# EAGLE design SuperPET OS9 MMU 3.0 (EAGLE 7.7.0)
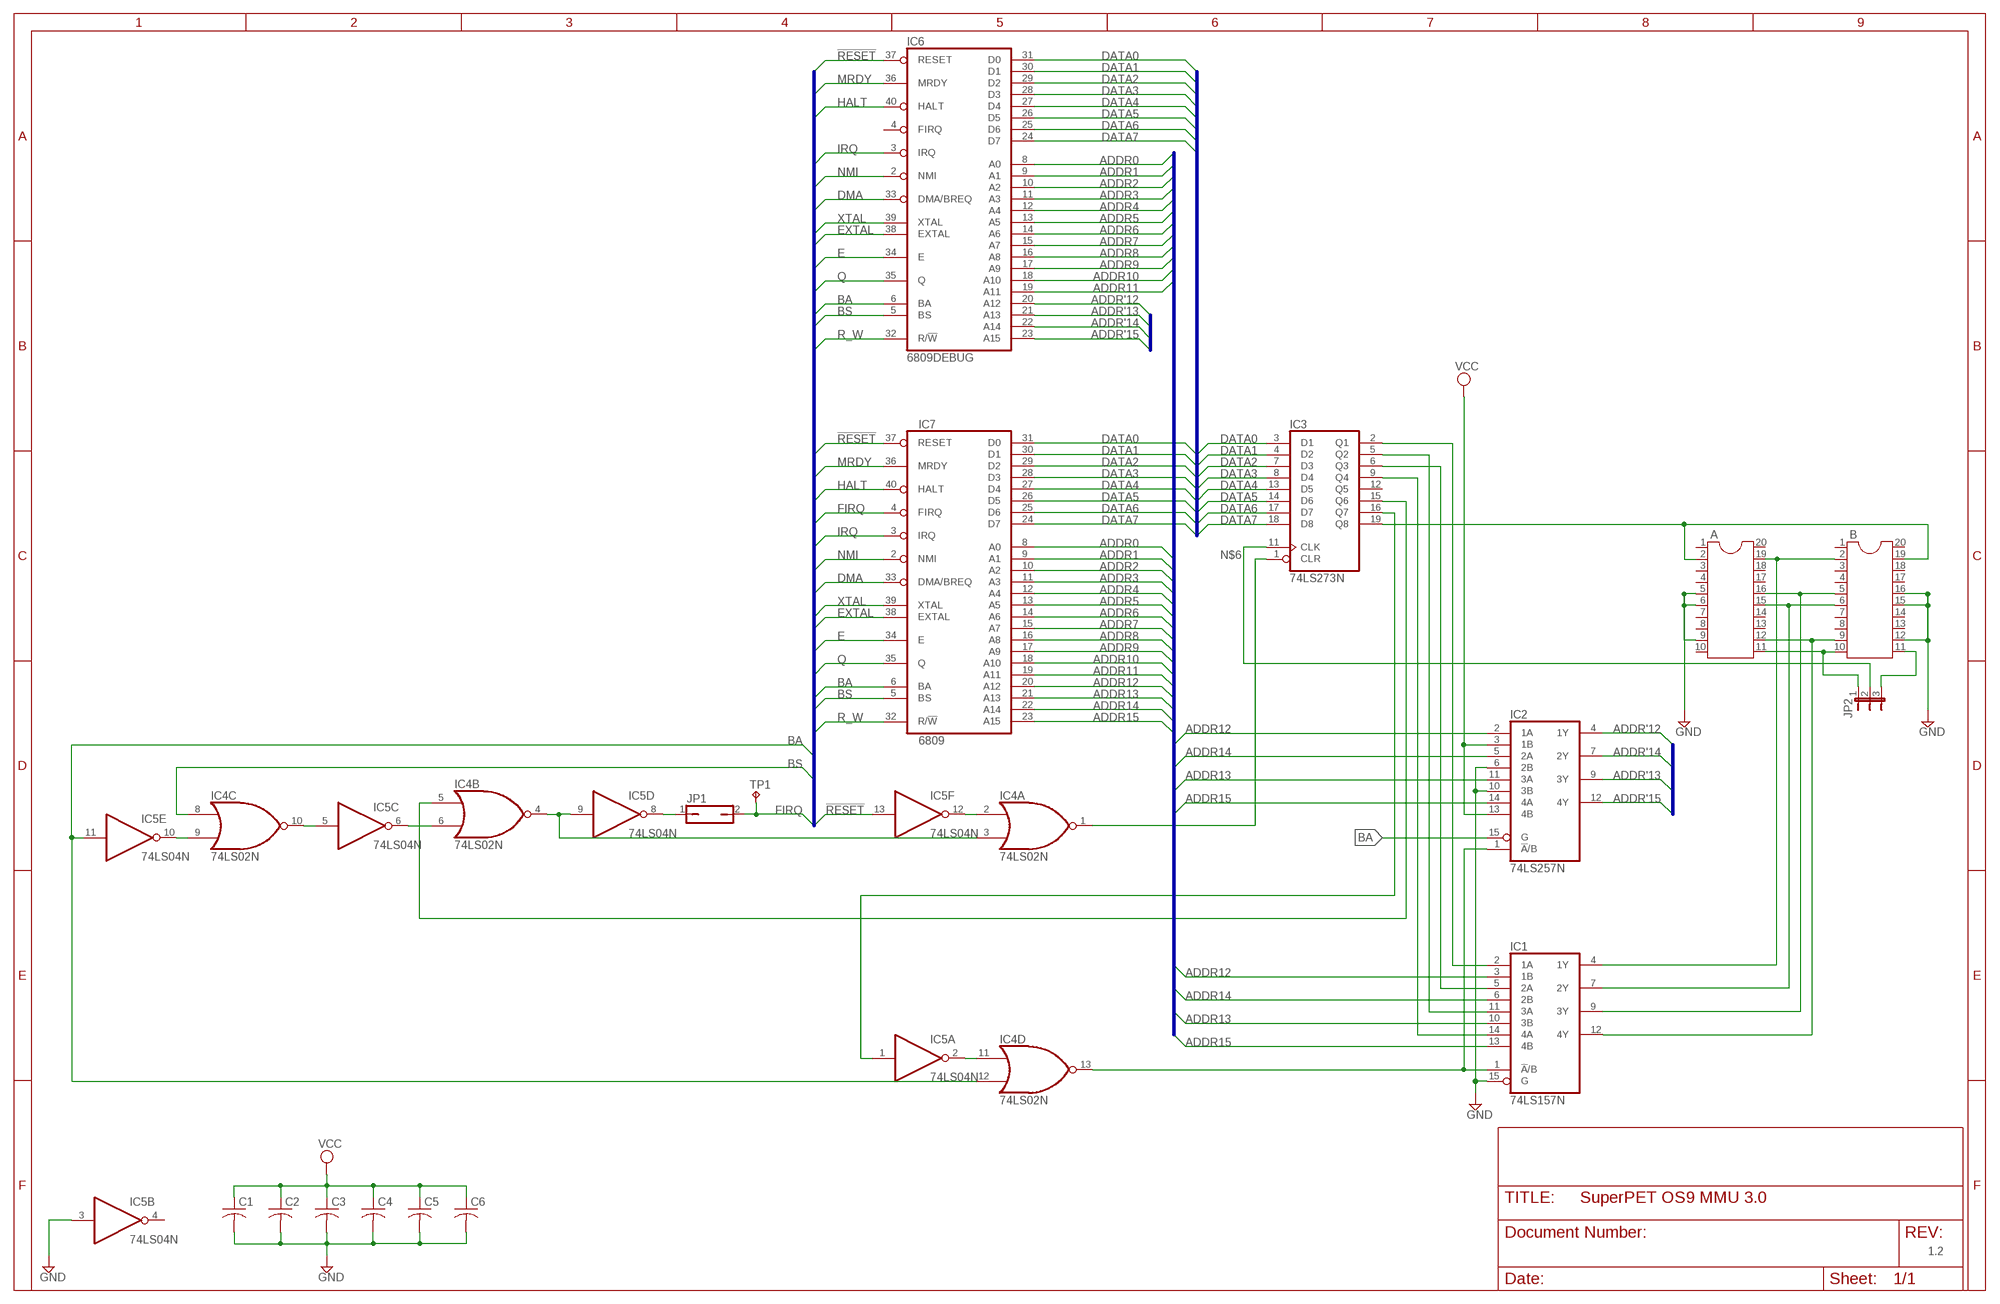
[diagram p0: schematic, sheet 1]

## Parts
A  DIL20S  [SOCKET-20]
B  DIL20S  [SOCKET-20]
C1  C-US050-025X075  [C050-025X075]
C2  C-US050-025X075  [C050-025X075]
C3  C-US050-025X075  [C050-025X075]
C4  C-US050-025X075  [C050-025X075]
C5  C-US050-025X075  [C050-025X075]
C6  C-US050-025X075  [C050-025X075]
IC1  74LS157N  [DIL16]
IC2  74LS257N  [DIL16]
IC3  74LS273N  74273N  [DIL20]
IC4  74LS02N  [DIL14]
IC5  74LS04N  [DIL14]
IC6  6809DEBUG  [DIL40]
IC7  6809  [DIL40]
JP1  JP1Q  [JP1]
JP2  JP2E  [JP2]
TP1  TPPAD1-13  [P1-13]

## Nets
!RESET: IC5.13(F:I) IC6.37(RESET) IC7.37(RESET)
ADDR0: IC6.8(A0) IC7.8(A0)
ADDR1: IC6.9(A1) IC7.9(A1)
ADDR2: IC6.10(A2) IC7.10(A2)
ADDR3: IC6.11(A3) IC7.11(A3)
ADDR4: IC6.12(A4) IC7.12(A4)
ADDR5: IC6.13(A5) IC7.13(A5)
ADDR6: IC6.14(A6) IC7.14(A6)
ADDR7: IC6.15(A7) IC7.15(A7)
ADDR8: IC6.16(A8) IC7.16(A8)
ADDR9: IC6.17(A9) IC7.17(A9)
ADDR10: IC6.18(A10) IC7.18(A10)
ADDR11: IC6.19(A11) IC7.19(A11)
ADDR12: IC1.3(1B) IC2.2(1A) IC7.20(A12)
ADDR13: IC1.10(3B) IC2.11(3A) IC7.21(A13)
ADDR14: IC1.6(2B) IC2.5(2A) IC7.22(A14)
ADDR15: IC1.13(4B) IC2.14(4A) IC7.23(A15)
ADDR'12: IC2.4(1Y) IC6.20(A12)
ADDR'13: IC2.9(3Y) IC6.21(A13)
ADDR'14: IC2.7(2Y) IC6.22(A14)
ADDR'15: IC2.12(4Y) IC6.23(A15)
BA: IC2.15(G) IC4.12(D:I1) IC5.11(E:I) IC6.6(BA) IC7.6(BA)
BS: IC4.8(C:I0) IC6.5(BS) IC7.5(BS)
DATA0: IC3.3(D1) IC6.31(D0) IC7.31(D0)
DATA1: IC3.4(D2) IC6.30(D1) IC7.30(D1)
DATA2: IC3.7(D3) IC6.29(D2) IC7.29(D2)
DATA3: IC3.8(D4) IC6.28(D3) IC7.28(D3)
DATA4: IC3.13(D5) IC6.27(D4) IC7.27(D4)
DATA5: IC3.14(D6) IC6.26(D5) IC7.26(D5)
DATA6: IC3.17(D7) IC6.25(D6) IC7.25(D6)
DATA7: IC3.18(D8) IC6.24(D7) IC7.24(D7)
DMA: IC6.33(DMA/BREQ) IC7.33(DMA/BREQ)
E: IC6.34(E) IC7.34(E)
EXTAL: IC6.38(EXTAL) IC7.38(EXTAL)
FIRQ: IC7.4(FIRQ) JP1.2 TP1.1(TP)
GND: A.5 A.6 A.9 B.12 B.15 B.16 C1.2 C2.2 C3.2 C4.2 C5.2 C6.2 IC1.15(G) IC2.6(2B) IC2.10(3B) IC5.3(B:I)
HALT: IC6.40(HALT) IC7.40(HALT)
IRQ: IC6.3(IRQ) IC7.3(IRQ)
MRDY: IC6.36(MRDY) IC7.36(MRDY)
N$5: IC1.1(!A!/B) IC2.1(!A!/B) IC4.13(D:O)
N$6: IC3.1(CLR) IC4.1(A:O)
N$7: IC4.2(A:I0) IC5.12(F:O)
N$8: IC5.8(D:O) JP1.1
N$9: IC4.3(A:I1) IC4.4(B:O) IC5.9(D:I)
N$10: IC3.15(Q6) IC4.5(B:I0)
N$11: IC4.6(B:I1) IC5.6(C:O)
N$12: IC4.10(C:O) IC5.5(C:I)
N$13: IC4.9(C:I1) IC5.10(E:O)
N$14: IC4.11(D:I0) IC5.2(A:O)
N$15: IC3.16(Q7) IC5.1(A:I)
N$16: IC1.2(1A) IC3.2(Q1)
N$17: IC1.14(4A) IC3.9(Q4)
N$18: IC1.11(3A) IC3.5(Q2)
N$19: A.15 B.6 IC1.7(2Y)
N$20: A.2 B.19 IC3.19(Q8)
N$21: A.12 B.9 IC1.12(4Y)
N$22: A.11 B.10 JP2.1
N$23: IC3.11(CLK) JP2.2
N$24: B.11 JP2.3
N$25: IC1.5(2A) IC3.6(Q3)
N$26: A.19 B.2 IC1.4(1Y)
N$27: A.16 B.5 IC1.9(3Y)
NMI: IC6.2(NMI) IC7.2(NMI)
Q: IC6.35(Q) IC7.35(Q)
R_W: IC6.32(R/!W) IC7.32(R/!W)
VCC: C1.1 C2.1 C3.1 C4.1 C5.1 C6.1 IC2.3(1B) IC2.13(4B)
XTAL: IC6.39(XTAL) IC7.39(XTAL)
Unconnected: A.1 A.3 A.4 A.7 A.8 A.10 A.13 A.14 A.17 A.18 A.20 B.1 B.3 B.4 B.7 B.8 B.13 B.14 B.17 B.18 B.20 IC3.12(Q5) IC5.4(B:O) IC6.4(FIRQ)

## Buses
RESET,MRDY,HALT,FIRQ,IRQ,NMI,DMA,XTAL,EXTAL,E,Q,BA,BS,R_W
ADDR[0..15]
DATA[0..7]
ADDR'[12..15]

## Notes on the sheet
- 1.2

## Power pins joined to a net without a drawn wire
GND: IC1.8(GND) IC2.8(GND) IC3.10(GND) IC4.7(P:GND) IC5.7(P:GND) IC6.1(GND) IC7.1(GND)
VCC: IC1.16(VCC) IC2.16(VCC) IC3.20(VCC) IC4.14(P:VCC) IC5.14(P:VCC) IC6.7(VCC) IC7.7(VCC)

## Library data of the parts
A B = ic-package:DIL20: Dual In Line / Socket
C1-C6 = rcl:C-US: CAPACITOR, American symbol
IC1 = 74xx-us:74*157: Quadruple 2-line to 1-line data SELECTOR/MULTIPLEXER
IC2 = 74xx-us:74*257: Quadruple 2-to 1 line data SELECTOR/MULTIPLEXER
IC3 = 74xx-us:74*273: Octal D type FLIP FLOP, clear
IC4 = 74xx-us:74*02: Quad 2-input NOR gate
IC5 = 74xx-us:74*04: Hex INVERTER
IC6 = 0RB_Motorola:6809DEBUG: 6809 counterpart to enable to replace the CPU with a PCB
IC7 = 0RB_Motorola:6809: 6809 processor
JP1 = jumper:JP1Q: JUMPER
JP2 = jumper:JP2E: JUMPER
TP1 = testpad:TP: Test pad

## Board
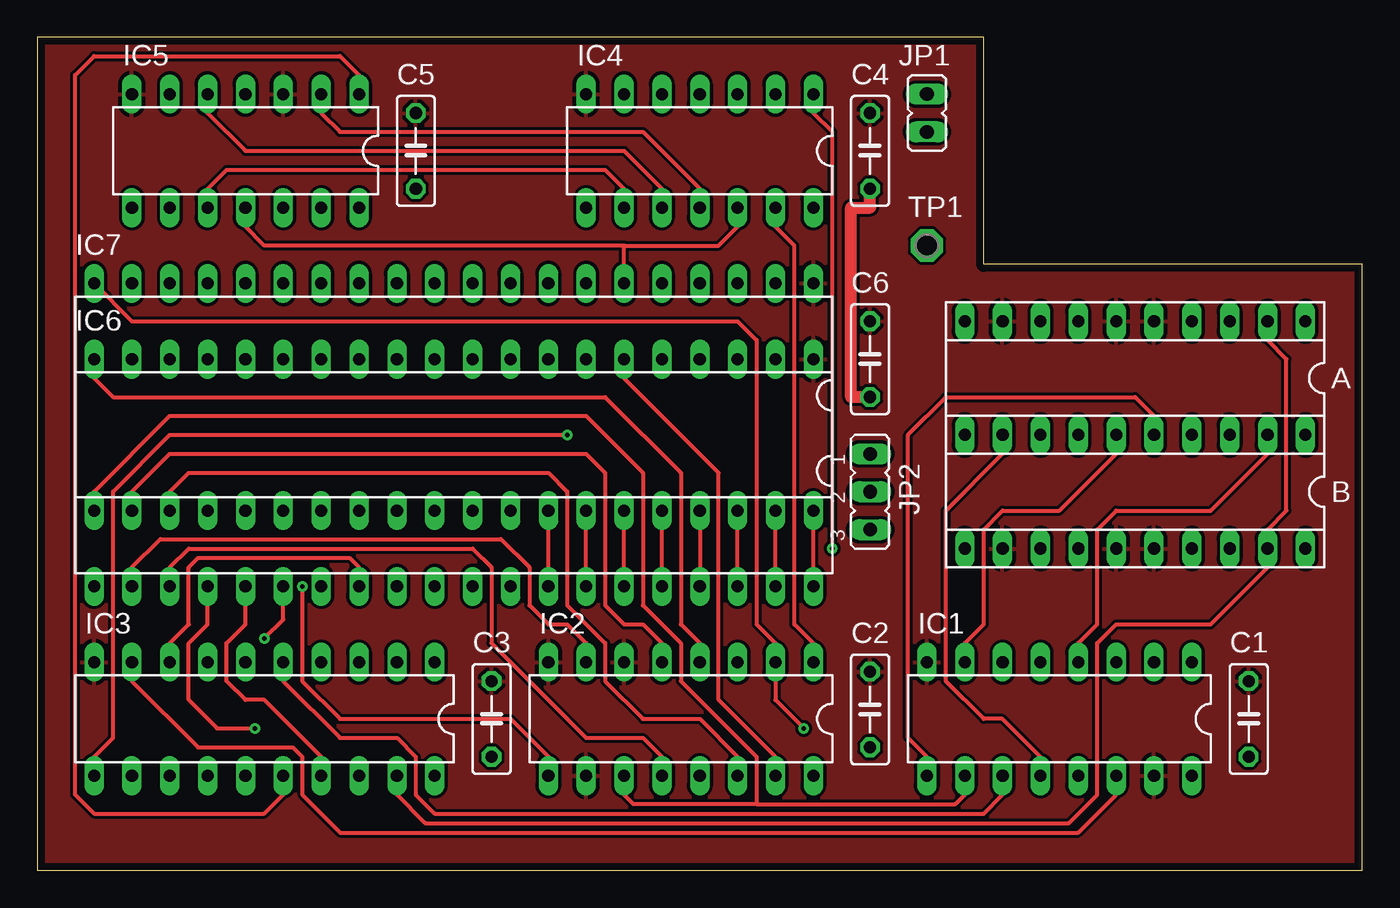
[diagram p1: board, top side]
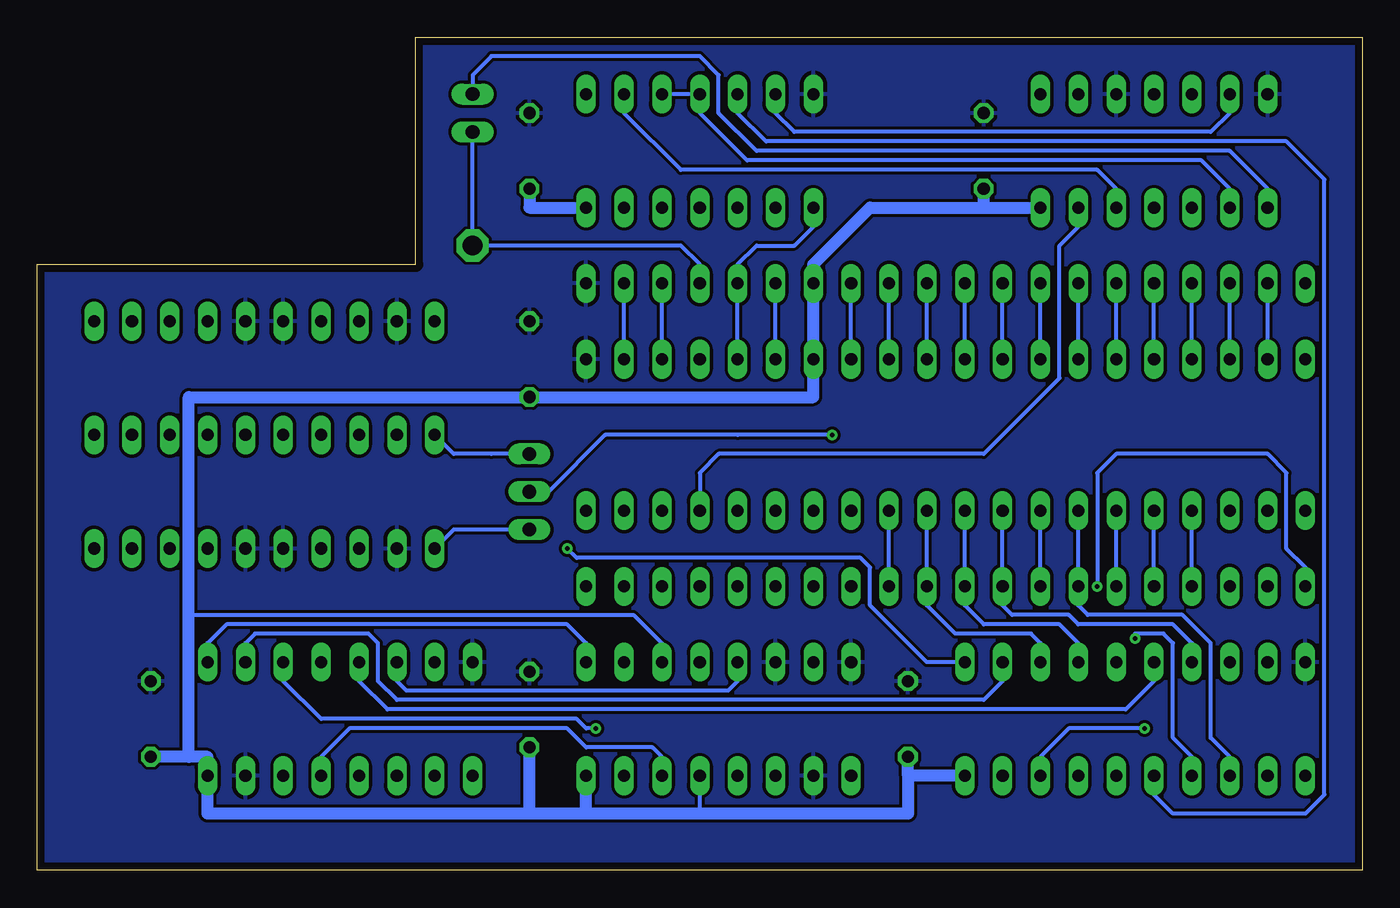
[diagram p2: board, bottom side, seen from below]

Size 88.9 x 55.88 mm. Coordinates in mm from the lower left corner, seen from the top.
Outline: 63.5,40.64 63.5,55.88 0,55.88 0,0 88.9,0 88.9,40.64 63.5,40.64
Copper layers (1*16): Top 0.035mm / dielectric 1.5mm / Bottom 0.035mm
Design rules "ourpcb-small *": minimum track width 4mil, minimum drill 12mil, track to track 8mil, track to pad 8mil, pad to pad 8mil, via to via 8mil, smd to smd 0mil, copper to edge 20mil, drill to drill 8mil, minimum pad ring 10mil, minimum via ring 8mil, stop-mask expansion 4mil, vias tented up to drill 0mil, thermal gap 10mil

### Footprints (pad centres in the part's own frame; a part is rotated, then mirrored left to right if it is on the bottom)
SOCKET-20 = drill 0.813 long: 1 -11.43,-3.81; 2 -8.89,-3.81; 3 -6.35,-3.81; 4 -3.81,-3.81; 5 -1.27,-3.81; 6 1.27,-3.81; 7 3.81,-3.81; 8 6.35,-3.81; 9 8.89,-3.81; 10 11.43,-3.81; 11 11.43,3.81; 12 8.89,3.81; 13 6.35,3.81; 14 3.81,3.81; 15 1.27,3.81; 16 -1.27,3.81; 17 -3.81,3.81; 18 -6.35,3.81; 19 -8.89,3.81; 20 -11.43,3.81
C050-025X075 = drill 0.813 octagon: 1 -2.54,0; 2 2.54,0
DIL16 = drill 0.813 long: 1 -8.89,-3.81; 2 -6.35,-3.81; 3 -3.81,-3.81; 4 -1.27,-3.81; 5 1.27,-3.81; 6 3.81,-3.81; 7 6.35,-3.81; 8 8.89,-3.81; 9 8.89,3.81; 10 6.35,3.81; 11 3.81,3.81; 12 1.27,3.81; 13 -1.27,3.81; 14 -3.81,3.81; 15 -6.35,3.81; 16 -8.89,3.81
DIL20 = drill 0.813 long: 1 -11.43,-3.81; 2 -8.89,-3.81; 3 -6.35,-3.81; 4 -3.81,-3.81; 5 -1.27,-3.81; 6 1.27,-3.81; 7 3.81,-3.81; 8 6.35,-3.81; 9 8.89,-3.81; 10 11.43,-3.81; 11 11.43,3.81; 12 8.89,3.81; 13 6.35,3.81; 14 3.81,3.81; 15 1.27,3.81; 16 -1.27,3.81; 17 -3.81,3.81; 18 -6.35,3.81; 19 -8.89,3.81; 20 -11.43,3.81
DIL14 = drill 0.813 long: 1 -7.62,-3.81; 2 -5.08,-3.81; 3 -2.54,-3.81; 4 0,-3.81; 5 2.54,-3.81; 6 5.08,-3.81; 7 7.62,-3.81; 8 7.62,3.81; 9 5.08,3.81; 10 2.54,3.81; 11 0,3.81; 12 -2.54,3.81; 13 -5.08,3.81; 14 -7.62,3.81
DIL40 = drill 0.813 long: 1 -24.13,-7.62; 2 -21.59,-7.62; 3 -19.05,-7.62; 4 -16.51,-7.62; 5 -13.97,-7.62; 6 -11.43,-7.62; 7 -8.89,-7.62; 8 -6.35,-7.62; 9 -3.81,-7.62; 10 -1.27,-7.62; 11 1.27,-7.62; 12 3.81,-7.62; 13 6.35,-7.62; 14 8.89,-7.62; 15 11.43,-7.62; 16 13.97,-7.62; 17 16.51,-7.62; 18 19.05,-7.62; 19 21.59,-7.62; 20 24.13,-7.62; 21 24.13,7.62; 22 21.59,7.62; 23 19.05,7.62; 24 16.51,7.62; 25 13.97,7.62; 26 11.43,7.62; 27 8.89,7.62; 28 6.35,7.62; 29 3.81,7.62; 30 1.27,7.62; 31 -1.27,7.62; 32 -3.81,7.62; 33 -6.35,7.62; 34 -8.89,7.62; 35 -11.43,7.62; 36 -13.97,7.62; 37 -16.51,7.62; 38 -19.05,7.62; 39 -21.59,7.62; 40 -24.13,7.62
JP1 = drill 0.914 long: 1 0,-1.27; 2 0,1.27
JP2 = drill 0.914 long: 1 -2.54,0; 2 0,0; 3 2.54,0
P1-13 = drill 1.321 pad 2.159 octagon: 1 0,0

### Placement (x,y rotation side)
A  73.66,33.02 180 top
B  73.66,25.4 180 top
C1  81.28,10.16 90 top
C2  55.88,10.79 90 top
C3  30.48,10.16 90 top
C4  55.88,48.26 90 top
C5  25.4,48.26 90 top
C6  55.88,34.29 90 top
IC1  68.58,10.16 180 top
IC2  43.18,10.16 180 top
IC3  15.24,10.16 180 top
IC4  44.45,48.26 180 top
IC5  13.97,48.26 180 top
IC6  27.94,26.67 180 top
IC7  27.94,31.75 180 top
JP1  59.69,50.8 180 top
JP2  55.88,25.4 270 top
TP1  59.69,41.91 270 top

### Tracks (layer width: path | path; a pad name or v marks a point on that pad's centre or on a via)
!RESET
  Top 0.254: IC7.37 IC6.37
  Bottom 0.254: IC5.13 19.05,43.18 20.32,41.91 20.32,33.02 25.4,27.94 43.18,27.94 44.45,26.67 IC7.37
ADDR0
  Bottom 0.254: IC6.8 IC7.8
ADDR1
  Bottom 0.254: IC6.9 IC7.9
ADDR2
  Bottom 0.254: IC6.10 IC7.10
ADDR3
  Bottom 0.254: IC6.11 IC7.11
ADDR4
  Bottom 0.254: IC6.12 IC7.12
ADDR5
  Bottom 0.254: IC6.13 IC7.13
ADDR6
  Bottom 0.254: IC6.14 IC7.14
ADDR7
  Bottom 0.254: IC6.15 IC7.15
ADDR8
  Bottom 0.254: IC6.16 IC7.16
ADDR9
  Bottom 0.254: IC6.17 IC7.17
ADDR10
  Bottom 0.254: IC6.18 IC7.18
ADDR11
  Bottom 0.254: IC6.19 IC7.19
ADDR12  (via drill 0.3)
  Top 0.254: v51.44,9.53 49.53,11.43 IC2.2 49.53,15.24 48.26,16.51 48.26,35.56 46.99,36.83 6.35,36.83 IC7.20
  Bottom 0.254: IC1.3 72.39,12.7 69.85,10.16 52.7,10.16 52.07,9.53 v51.44,9.53
ADDR13
  Top 0.254: IC1.10 62.23,5.08 61.59,4.44 48.26,4.44 | 48.26,4.44 40.01,4.44 39.37,5.08 IC2.11 | IC7.21 3.81,25.4 8.89,30.48 36.83,30.48 40.64,26.67 40.64,17.78 43.18,15.24 43.18,12.7 48.26,7.62 48.26,4.44
ADDR14
  Top 0.254: IC7.22 6.35,25.4 8.89,27.94 36.83,27.94 38.1,26.67 38.1,17.78 39.37,16.51 40.64,16.51 41.91,15.24 IC2.5
  Bottom 0.254: IC1.6 64.77,12.7 64.14,12.06 42.55,12.06 41.91,12.7 IC2.5
ADDR15
  Top 0.254: IC7.23 8.89,25.4 10.16,26.67 34.29,26.67 35.56,25.4 35.56,17.78 38.1,15.24 38.1,12.7 40.64,10.16 44.45,10.16 46.99,7.62 IC2.14
  Bottom 0.254: IC1.13 69.85,7.62 67.94,9.53 53.34,9.53 52.07,8.26 47.62,8.26 46.99,7.62 IC2.14
ADDR'12
  Top 0.254: IC6.20 3.81,33.02 5.08,31.75 38.1,31.75 43.18,26.67 43.18,16.51 44.45,15.24 IC2.4
ADDR'13  (via drill 0.3)
  Top 0.254: v17.78,19.05 17.78,12.7 20.32,10.16 31.75,10.16 34.29,7.62 IC2.9
  Bottom 0.254: IC6.21 3.81,20.32 5.08,21.59 5.08,26.67 6.35,27.94 16.51,27.94 17.78,26.67 v17.78,19.05
ADDR'14
  Top 0.254: IC6.22 6.35,20.32 8.26,22.23 31.11,22.23 33.02,20.32 33.02,17.78 34.29,16.51 35.56,16.51 36.83,15.24 IC2.7
ADDR'15
  Top 0.254: IC6.23 8.89,20.32 10.16,21.59 29.21,21.59 30.48,20.32 30.48,15.24 36.83,8.89 40.64,8.89 41.91,7.62 IC2.12
BA
  Top 0.254: IC5.11 13.97,43.18 15.24,41.91 39.37,41.91 | IC4.12 46.99,43.18 45.72,41.91 39.37,41.91 | IC6.6 39.37,33.02 45.72,26.67 45.72,11.43 49.53,7.62 IC2.15 | IC7.6 39.37,41.91
  Bottom 0.254: IC6.6 IC7.6
BS
  Bottom 0.254: IC4.8 36.83,43.18 38.1,41.91 40.64,41.91 41.91,40.64 IC7.5 IC6.5
DATA0
  Bottom 0.254: IC3.3 21.59,15.24 22.23,15.87 27.3,15.87 29.21,17.78 IC6.31 IC7.31
DATA1
  Bottom 0.254: IC3.4 19.05,15.24 20.32,16.51 25.4,16.51 26.67,17.78 IC6.30 IC7.30
DATA2
  Bottom 0.254: IC3.7 11.43,15.24 12.7,16.51 19.05,16.51 19.68,17.14 23.5,17.14 24.13,17.78 IC6.29 IC7.29
DATA3
  Top 0.254: IC3.8 8.89,15.24 10.16,16.51 10.16,20.32 10.79,20.95 20.95,20.95 21.59,20.32 IC6.28
  Bottom 0.254: IC6.28 IC7.28
DATA4
  Bottom 0.254: IC3.13 8.89,7.62 10.16,8.89 10.16,15.24 12.06,17.14 18.41,17.14 19.05,17.78 IC6.27 IC7.27
DATA5  (via drill 0.3)
  Top 0.254: v15.24,15.56 16.51,16.83 IC6.26
  Bottom 0.254: IC3.14 11.43,7.62 12.7,8.89 12.7,15.24 13.34,15.87 15.24,15.87 v15.24,15.56 | IC6.26 IC7.26
DATA6
  Top 0.254: IC3.17 19.05,7.62 15.24,11.43 13.97,11.43 12.7,12.7 12.7,15.24 13.97,16.51 IC6.25
  Bottom 0.254: IC6.25 IC7.25
DATA7  (via drill 0.3)
  Top 0.254: IC6.24 11.43,16.51 10.16,15.24 10.16,11.43 12.06,9.53 v14.61,9.53
  Bottom 0.254: v14.61,9.53 19.68,9.53 21.59,7.62 IC3.18 | IC6.24 IC7.24
DMA
  Top 0.254: IC6.33 IC7.33
E
  Top 0.254: IC6.34 IC7.34
EXTAL
  Top 0.254: IC6.38 IC7.38
FIRQ
  Bottom 0.254: JP1.2 TP1.1 45.72,41.91 44.45,40.64 IC7.4
GND
  pour Bottom: 0,55.88 63.5,55.88 63.5,40.64 88.9,40.64 88.9,0 0,0
  pour Top: 0,55.88 63.5,55.88 63.5,40.64 88.9,40.64 88.9,0 0,0
HALT
  Top 0.254: IC6.40 IC7.40
IRQ
  Bottom 0.254: IC6.3 IC7.3
MRDY
  Top 0.254: IC6.36 IC7.36
N$5
  Top 0.254: IC4.13 49.53,43.18 50.8,41.91 50.8,16.51 52.07,15.24 IC2.1
  Bottom 0.254: IC1.1 77.47,15.24 76.2,16.51 53.34,16.51 52.07,15.24 IC2.1
N$6  (via drill 0.3)
  Top 0.254: IC4.1 52.07,50.8 53.34,49.53 v53.34,21.59
  Bottom 0.254: v53.34,21.59 52.7,20.95 33.66,20.95 33.02,20.32 33.02,17.78 29.21,13.97 IC3.1
N$7
  Bottom 0.254: IC5.12 16.51,45.72 17.78,46.99 45.72,46.99 49.53,50.8 IC4.2
N$8
  Bottom 0.254: JP1.1 59.69,53.34 58.42,54.61 44.45,54.61 43.18,53.34 43.18,50.8 40.64,48.26 8.89,48.26 6.35,45.72 IC5.8
N$9
  Bottom 0.254: IC5.9 8.89,45.72 10.79,47.62 41.27,47.62 44.45,50.8 IC4.4 IC4.3
N$10
  Bottom 0.254: IC3.15 13.97,5.08 12.7,3.81 3.81,3.81 2.54,5.08 2.54,46.36 5.08,48.9 40.01,48.9 41.91,50.8 IC4.5
N$11
  Bottom 0.254: IC5.6 8.89,50.8 10.16,49.53 38.1,49.53 39.37,50.8 IC4.6
N$12
  Top 0.254: IC5.5 11.43,50.8 13.97,48.26 39.37,48.26 41.91,45.72 IC4.10
N$13
  Top 0.254: IC4.9 39.37,45.72 38.1,46.99 12.7,46.99 11.43,45.72 IC5.10
N$14
  Top 0.254: IC4.11 44.45,45.72 40.64,49.53 20.32,49.53 19.05,50.8 IC5.2
N$15
  Top 0.254: IC3.16 16.51,5.08 15.24,3.81 3.81,3.81 2.54,5.08 2.54,53.34 3.81,54.61 20.32,54.61 21.59,53.34 IC5.1
N$16
  Bottom 0.254: IC3.2 24.13,12.7 25.4,11.43 64.77,11.43 66.04,12.7 66.04,15.24 66.67,15.87 74.3,15.87 74.93,15.24 IC1.2
N$17
  Top 0.254: IC3.9 6.35,12.7 10.79,8.26 17.14,8.26 17.78,7.62 17.78,5.08 20.32,2.54 69.85,2.54 72.39,5.08 IC1.14
N$18
  Top 0.254: IC1.11 64.77,5.08 63.5,3.81 26.67,3.81 25.4,5.08 25.4,7.62 24.13,8.89 20.32,8.89 16.51,12.7 IC3.5
N$19
  Top 0.254: A.15 72.39,27.94 68.58,24.13 64.77,24.13 63.5,22.86 63.5,16.51 62.23,15.24 IC1.7
N$20
  Top 0.254: IC3.19 24.13,5.08 26.04,3.17 69.22,3.17 71.12,5.08 71.12,15.24 72.39,16.51 78.74,16.51 82.55,20.32 B.19 82.55,22.86 83.82,24.13 83.82,34.29 82.55,35.56 A.2
N$21
  Top 0.254: A.12 64.77,27.94 60.96,24.13 60.96,12.7 63.5,10.16 64.77,10.16 67.31,7.62 IC1.12
N$22
  Bottom 0.254: JP2.1 58.42,27.94 60.96,27.94 A.11
N$23  (via drill 0.3)
  Top 0.254: IC3.11 3.81,7.62 5.08,8.89 5.08,25.4 8.89,29.21 v35.56,29.21
  Bottom 0.254: v35.56,29.21 41.91,29.21 50.8,29.21 54.61,25.4 JP2.2
N$24
  Bottom 0.254: JP2.3 57.15,22.86 60.96,22.86 B.11
N$25
  Bottom 0.254: IC3.6 13.97,12.7 15.88,10.79 65.41,10.79 67.31,12.7 IC1.5
N$26
  Top 0.254: A.19 82.55,27.94 78.74,24.13 72.39,24.13 71.12,22.86 71.12,16.51 69.85,15.24 IC1.4
N$27
  Top 0.254: IC1.9 59.69,7.62 58.42,8.89 58.42,29.21 60.96,31.75 73.66,31.75 74.93,30.48 A.16
NMI
  Bottom 0.254: IC6.2 IC7.2
Q
  Top 0.254: IC6.35 IC7.35
R_W
  Bottom 0.254: IC6.32 IC7.32
VCC
  Top 0.813: C6.1 54.61,31.75 54.61,44.45 55.88,44.45 C4.1
  Bottom 0.254: 44.45,3.81 IC2.13 | IC2.3 46.99,15.24 48.9,17.14 78.74,17.14
  Bottom 0.813: 25.4,44.45 IC5.14 | 25.4,44.45 33.02,44.45 36.83,40.64 IC7.7 IC6.7 36.83,31.75 C6.1 78.74,31.75 78.74,17.14 78.74,7.62 | C4.1 55.88,44.45 IC4.14 | IC3.20 30.48,6.35 | 52.07,3.81 44.45,3.81 30.48,3.81 30.48,6.35 | 30.48,6.35 C3.1 | 52.07,3.81 IC2.16 | 52.07,3.81 55.88,3.81 | 55.88,3.81 C2.1 | 55.88,3.81 77.47,3.81 IC1.16 77.47,7.62 78.74,7.62 | 78.74,7.62 C1.1 | 25.4,44.45 C5.1
XTAL
  Top 0.254: IC6.39 IC7.39

### Text on the board
tValues: A | Based on Super OS/9 MMU v2.0 (c)1985 TPUG